# Altium schematic sheet USB PORT STACKED.SchDoc: USB Port
size 279 x 215 mm; CheckedBy: Lance Bantoto; Engineer: Cindy Li; DocumentNumber: 14; Revision: 1; SheetNumber: 14; SheetTotal: 23
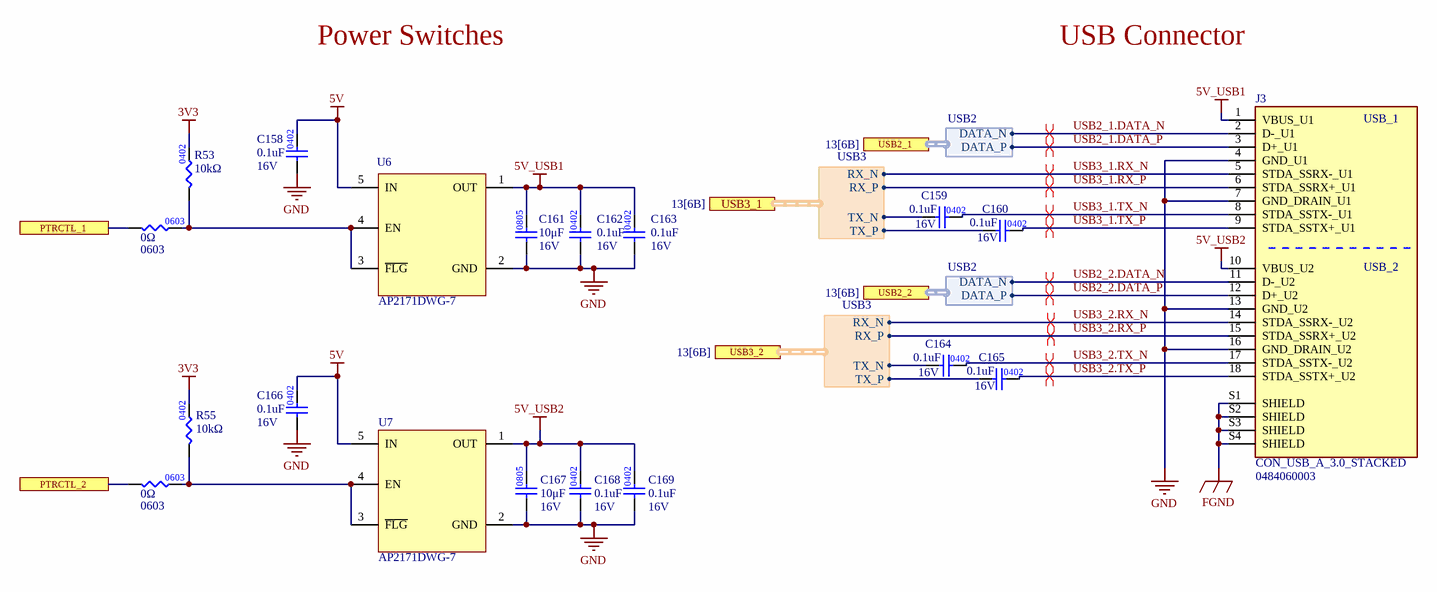
[diagram p0: USB PORT STACKED.SchDoc]

## Parts
C158  Rated DC Voltage (URdc): 16V  Capacitance: 0.1uF  [CAP0402]  (hidden comment: CAP_0.1uF_16V_X7R_0402)
C159  Capacitance: 0.1uF  Rated DC Voltage (URdc): 16V  [CAP0402]  (hidden comment: CAP_0.1uF_16V_X7R_0402)
C160  Capacitance: 0.1uF  Rated DC Voltage (URdc): 16V  [CAP0402]  (hidden comment: CAP_0.1uF_16V_X7R_0402)
C161  value 10μF  Voltage Rating: 16V  [CAP2012]  (hidden comment: CAP_10uF_16V_0805)
C162  Rated DC Voltage (URdc): 16V  Capacitance: 0.1uF  [CAP0402]  (hidden comment: CAP_0.1uF_16V_X7R_0402)
C163  Rated DC Voltage (URdc): 16V  Capacitance: 0.1uF  [CAP0402]  (hidden comment: CAP_0.1uF_16V_X7R_0402)
C164  Capacitance: 0.1uF  Rated DC Voltage (URdc): 16V  [CAP0402]  (hidden comment: CAP_0.1uF_16V_X7R_0402)
C165  Capacitance: 0.1uF  Rated DC Voltage (URdc): 16V  [CAP0402]  (hidden comment: CAP_0.1uF_16V_X7R_0402)
C166  Rated DC Voltage (URdc): 16V  Capacitance: 0.1uF  [CAP0402]  (hidden comment: CAP_0.1uF_16V_X7R_0402)
C167  value 10μF  Voltage Rating: 16V  [CAP2012]  (hidden comment: CAP_10uF_16V_0805)
C168  Rated DC Voltage (URdc): 16V  Capacitance: 0.1uF  [CAP0402]  (hidden comment: CAP_0.1uF_16V_X7R_0402)
C169  Rated DC Voltage (URdc): 16V  Capacitance: 0.1uF  [CAP0402]  (hidden comment: CAP_0.1uF_16V_X7R_0402)
J3  CON_USB_A_3.0_STACKED  Manufacturer Part Number 1: 0484060003  [MOLEX_0484060003]
R53  value 10kΩ  [RES0402]  (hidden comment: RES_10kΩ_0402_1%)
R54  value 0Ω  Package/Footprint: 0603  [RES0603]  (hidden comment: RES_0Ω_0603)
R55  value 10kΩ  [RES0402]  (hidden comment: RES_10kΩ_0402_1%)
R56  value 0Ω  Package/Footprint: 0603  [RES0603]  (hidden comment: RES_0Ω_0603)
U6  AP2171DWG-7  [AP2171DWG-7]
U7  AP2171DWG-7  [AP2171DWG-7]

## Ports
PTRCTL_1, PTRCTL_2, USB2_1 (harness USB2, see 13[6B]), USB2_2 (harness USB2, see 13[6B]), USB3_1 (harness USB3, see 13[6B]), USB3_2 (harness USB3, see 13[6B])

## Harnesses
USB3: RX_N, RX_P, TX_N, TX_P
USB2: DATA_N, DATA_P

## Nets
3V3: R53.2 R55.2
5V: C158.2 C166.2 U6.5(IN) U7.5(IN)
5V_USB1: C161.2 C162.2 C163.2 J3.1(VBUS_U1) U6.1(OUT)
5V_USB2: C167.2 C168.2 C169.2 J3.10(VBUS_U2) U7.1(OUT)
FGND: J3.S1(SHIELD) J3.S2(SHIELD) J3.S3(SHIELD) J3.S4(SHIELD)
GND: C158.1 C161.1 C162.1 C163.1 C166.1 C167.1 C168.1 C169.1 J3.4(GND_U1) J3.7(GND_DRAIN_U1) J3.13(GND_U2) J3.16(GND_DRAIN_U2) U6.2(GND) U7.2(GND)
PTRCTL_1: R54.1 ; port PTRCTL_1
PTRCTL_2: R56.1 ; port PTRCTL_2
USB2_1.DATA_N: J3.2(D-_U1) ; port USB2_1.DATA_N
USB2_1.DATA_P: J3.3(D+_U1) ; port USB2_1.DATA_P
USB2_2.DATA_N: J3.11(D-_U2) ; port USB2_2.DATA_N
USB2_2.DATA_P: J3.12(D+_U2) ; port USB2_2.DATA_P
USB3_1.RX_N: J3.5(STDA_SSRX-_U1) ; port USB3_1.RX_N
USB3_1.RX_P: J3.6(STDA_SSRX+_U1) ; port USB3_1.RX_P
USB3_1.TX_N: C159.2 J3.8(STDA_SSTX-_U1)
USB3_1.TX_P: C160.2 J3.9(STDA_SSTX+_U1)
USB3_2.RX_N: J3.14(STDA_SSRX-_U2)
USB3_2.RX_P: J3.15(STDA_SSRX+_U2)
USB3_2.TX_N: C164.2 J3.17(STDA_SSTX-_U2)
USB3_2.TX_P: C165.2 J3.18(STDA_SSTX+_U2)
NetC159_1: C159.1 ; port USB3_1.TX_N
NetC160_1: C160.1 ; port USB3_1.TX_P
NetC164_1: C164.1 ; port USB3_2.TX_N
NetC165_1: C165.1 ; port USB3_2.TX_P
NetR53_1: R53.1 R54.2 U6.3(~{FLG}) U6.4(EN)
NetR55_1: R55.1 R56.2 U7.3(~{FLG}) U7.4(EN)

## Layout directives
differential pair: USB2_1.DATA_N, USB2_1.DATA_P, USB2_2.DATA_N, USB2_2.DATA_P, USB3_1.RX_N, USB3_1.RX_P, USB3_1.TX_N, USB3_1.TX_P, USB3_2.RX_N, USB3_2.RX_P, USB3_2.TX_N, USB3_2.TX_P

## Notes on the sheet
- Power Switches
- USB Connector
- University of Waterloo Robotics Team
- 200 University Ave W
- REV
- PROJECT
- Waterloo, Ontario, Canada
- N2L 3G1
- DOCUMENT
- ENGINEER
- REVIEWER
- MODIFIED
- SHEET
- OF
- (in symbol CON_USB_A_3.0_STACKED) USB_1; USB_2

## Library data of the parts
C158-C160 C162-C166 C168 C169 = CAP_0.1uF_16V_X7R_0402: Ceramic Capacitor, Ceramic; Manufacturer: Taiyo Yuden; Manufacturer Part Number: LMK212AC6106MD-T; Multilayer: Yes; Negative Tolerance: 10%; Temperature Characteristics Code: X7R; Supplier Part Number 1: 587-6337-1-ND; Supplier 1: Digi-Key; RoHS: Yes; Stock 1: 703; Pricing 1: 1=0.29000, 10=0.20100, 50=0.12060, 100=0.10180, 500=0.06966, 1000=0.06163 (USD); ComponentLink1URL: https://datasheet.ciiva.com:443/pdfs/VipMasterIC/IC/TAIY/TAIY-S-A0009099504/TAIY-S-A0009099407-1.pdf?src-supplier=IHS+Markit; ComponentLink1Description: https://datasheet.ciiva.com:443/pdfs/VipMasterIC/IC/TAIY/TAIY-S-A0009099504/TAIY-S-A0009099407-1.pdf?src-supplier=IHS+Markit; ComponentLink2URL: https://ds.yuden.co.jp/TYCOMPAS/ut/detail?pn=LMK212AC6106MD-T &amp;u=M&src-supplier=Digi-Key; ComponentLink2Description: https://ds.yuden.co.jp/TYCOMPAS/ut/detail?pn=LMK212AC6106MD-T &amp;u=M&src-supplier=Digi-Key; Supplier 2: Digi-Key; Supplier Part Number 2: 1292-1630-1-ND; Category: Ceramic Capacitors; Stock 2: 20327886; Pricing 2: 1=0.10000, 10=0.02800, 50=0.01500, 100=0.01220, 500=0.00876, 1000=0.00688, 2500=0.00625, 5000=0.00575 (USD); Mount: Surface Mount; Number of Pins: 2; Dielectric Material: Ceramic; Package Shape: Rectangular; Terminal Finish: Nickel; Min Operating Temperature: -55°C; Max Operating Temperature: 125°C; JESD-609 Code: e3; Capacitor Type: Ceramic; Package Style: SMTMeter; Packaging: Tape and Reel; Positive Tolerance: 10%; Termination: Wraparound; Length: 1mm; Width: 0.5mm; Height: 0.5mm; REACH SVHC: Yes; RoHS Compliant: Yes; ComponentLink3URL: https://datasheet.ciiva.com:443/pdfs/VipMasterIC/IC/WATC/WATC-S-A0009550342/WATC-S-A0009550342-1.pdf?src-supplier=IHS+Markit; ComponentLink3Description: https://datasheet.ciiva.com:443/pdfs/VipMasterIC/IC/WATC/WATC-S-A0009550342/WATC-S-A0009550342-1.pdf?src-supplier=IHS+Markit; ComponentLink4URL: http://www.farnell.com/datasheets/2340522.pdf?src-supplier=Farnell; ComponentLink4Description: http://www.farnell.com/datasheets/2340522.pdf?src-supplier=Farnell; ComponentLink5URL: http://components.arrow.com/part/dataview/0323_00654690?src-supplier=Arrow+Europe; ComponentLink5Description: http://components.arrow.com/part/dataview/0323_00654690?src-supplier=Arrow+Europe; ComponentLink6URL: https://www.verical.com/server-webapp/html/getDatasheet?partID=415228&src-supplier=Verical; ComponentLink6Description: https://www.verical.com/server-webapp/html/getDatasheet?partID=415228&src-supplier=Verical; ComponentLink7URL: http://www.passivecomponent.com/indexsea/0402B104K160CT-IN.pdf?src-supplier=Digi-Key; ComponentLink7Description: http://www.passivecomponent.com/indexsea/0402B104K160CT-IN.pdf?src-supplier=Digi-Key; ComponentLink8URL: http://www.passivecomponent.com/wp-content/uploads/2018/10/MLCC.pdf?src-supplier=Digi-Key; ComponentLink8Description: http://www.passivecomponent.com/wp-content/uploads/2018/10/MLCC.pdf?src-supplier=Digi-Key; ComponentLink9URL: http://www.farnell.com/datasheets/2340522.pdf?src-supplier=Element14; ComponentLink9Description: http://www.farnell.com/datasheets/2340522.pdf?src-supplier=Element14; ComponentLink10URL: http://www.farnell.com/datasheets/2340522.pdf?src-supplier=Newark; ComponentLink10Description: http://www.farnell.com/datasheets/2340522.pdf?src-supplier=Newark; Size Code: 0402; Supplier 3: Digi-Key; Supplier Part Number 3: 445-173645-1-ND; Stock 3: 3627; Pricing 3: 1=0.20000, 10=0.14200, 50=0.08080, 100=0.06700, 500=0.04696, 1000=0.03888, 2500=0.03619, 5000=0.03311 (USD); ComponentLink11URL: https://datasheet.ciiva.com:443/pdfs/VipMasterIC/IC/TDKC/TDKC-S-A0007785269/TDKC-S-A0007785269-1.pdf?src-supplier=IHS+Markit; ComponentLink11Description: https://datasheet.ciiva.com:443/pdfs/VipMasterIC/IC/TDKC/TDKC-S-A0007785269/TDKC-S-A0007785269-1.pdf?src-supplier=IHS+Markit; ComponentLink12URL: https://product.tdk.com/info/en/catalog/spec/mlccspec_commercial_soft_en.pdf?src-supplier=Digi-Key; ComponentLink12Description: https://product.tdk.com/info/en/catalog/spec/mlccspec_commercial_soft_en.pdf?src-supplier=Digi-Key
C161 C167 = CAP_10uF_16V_0805: CAP CER 10UF 16V X5R 0805; Manufacturer 1: Yageo; Manufacturer Part Number 1: CC0805KKX5R7BB106; Package/Footprint: 0805; Supplier Part Number 1: 311-1865-1-ND; Supplier 1: Digi-Key; Mounting Type: SMD; Dielectric: X5R
J3 = CON_USB_A_3.0_STACKED: CONN RCPT USB3.0 TYPEA STACK R/A; Manufacturer 1: Molex; Specifications: USB 3.2 Gen 1; Current Rating: 0.25A, 1.8A; Voltage Rating: 30VAC/DC; Number of Ports: 2; Supplier 1: Digi-Key; Supplier Part Number 1: WM10420-ND; Mounting Type: Through Hole, Right Angle
R53 R55 = RES_10kΩ_0402_1%: RES SMD 10K OHM 1% 1/16W 0402; Manufacturer Part Number 1: CRCW040210K0FKTD; Manufacturer 1: Vishay Dale; Power: 0.063W, 1/16W; Package/Footprint: 0402; Supplier 1: Digi-Key; Supplier Part Number 1: 541-2955-1-ND; Mounting Type: SMD; Tolerance: 1%
R54 R56 = RES_0Ω_0603: RES 0 OHM JUMPER 1/10W 0603; Manufacturer 1: Yageo; Manufacturer Part Number 1: RC0603JR-070RL; Supplier Part Number 1: 311-0.0GRCT-ND; Supplier 1: Digi-Key; Mounting Type: SMD
U6 U7 = AP2171DWG-7: IC PWR SWITCH P-CHAN 1:1 SOT25; Manufacturer 1: Diodes Incorporated; Rds On (Typ): 95mOhm; Voltage - Load: 2.7V - 5.5V; Current - Output (Max): 1A; Supplier 1: Digi-Key; Supplier Part Number 1: AP2171DWG-7DICT-ND; Manufacturer Part Number 1: AP2171DWG-7; Package: SOT-25